# Altium schematic sheet ethernet_ipphone_sch.SchDoc: IP PHONE Ethernet
size A3; SheetNumber: 1; SheetTotal: 1
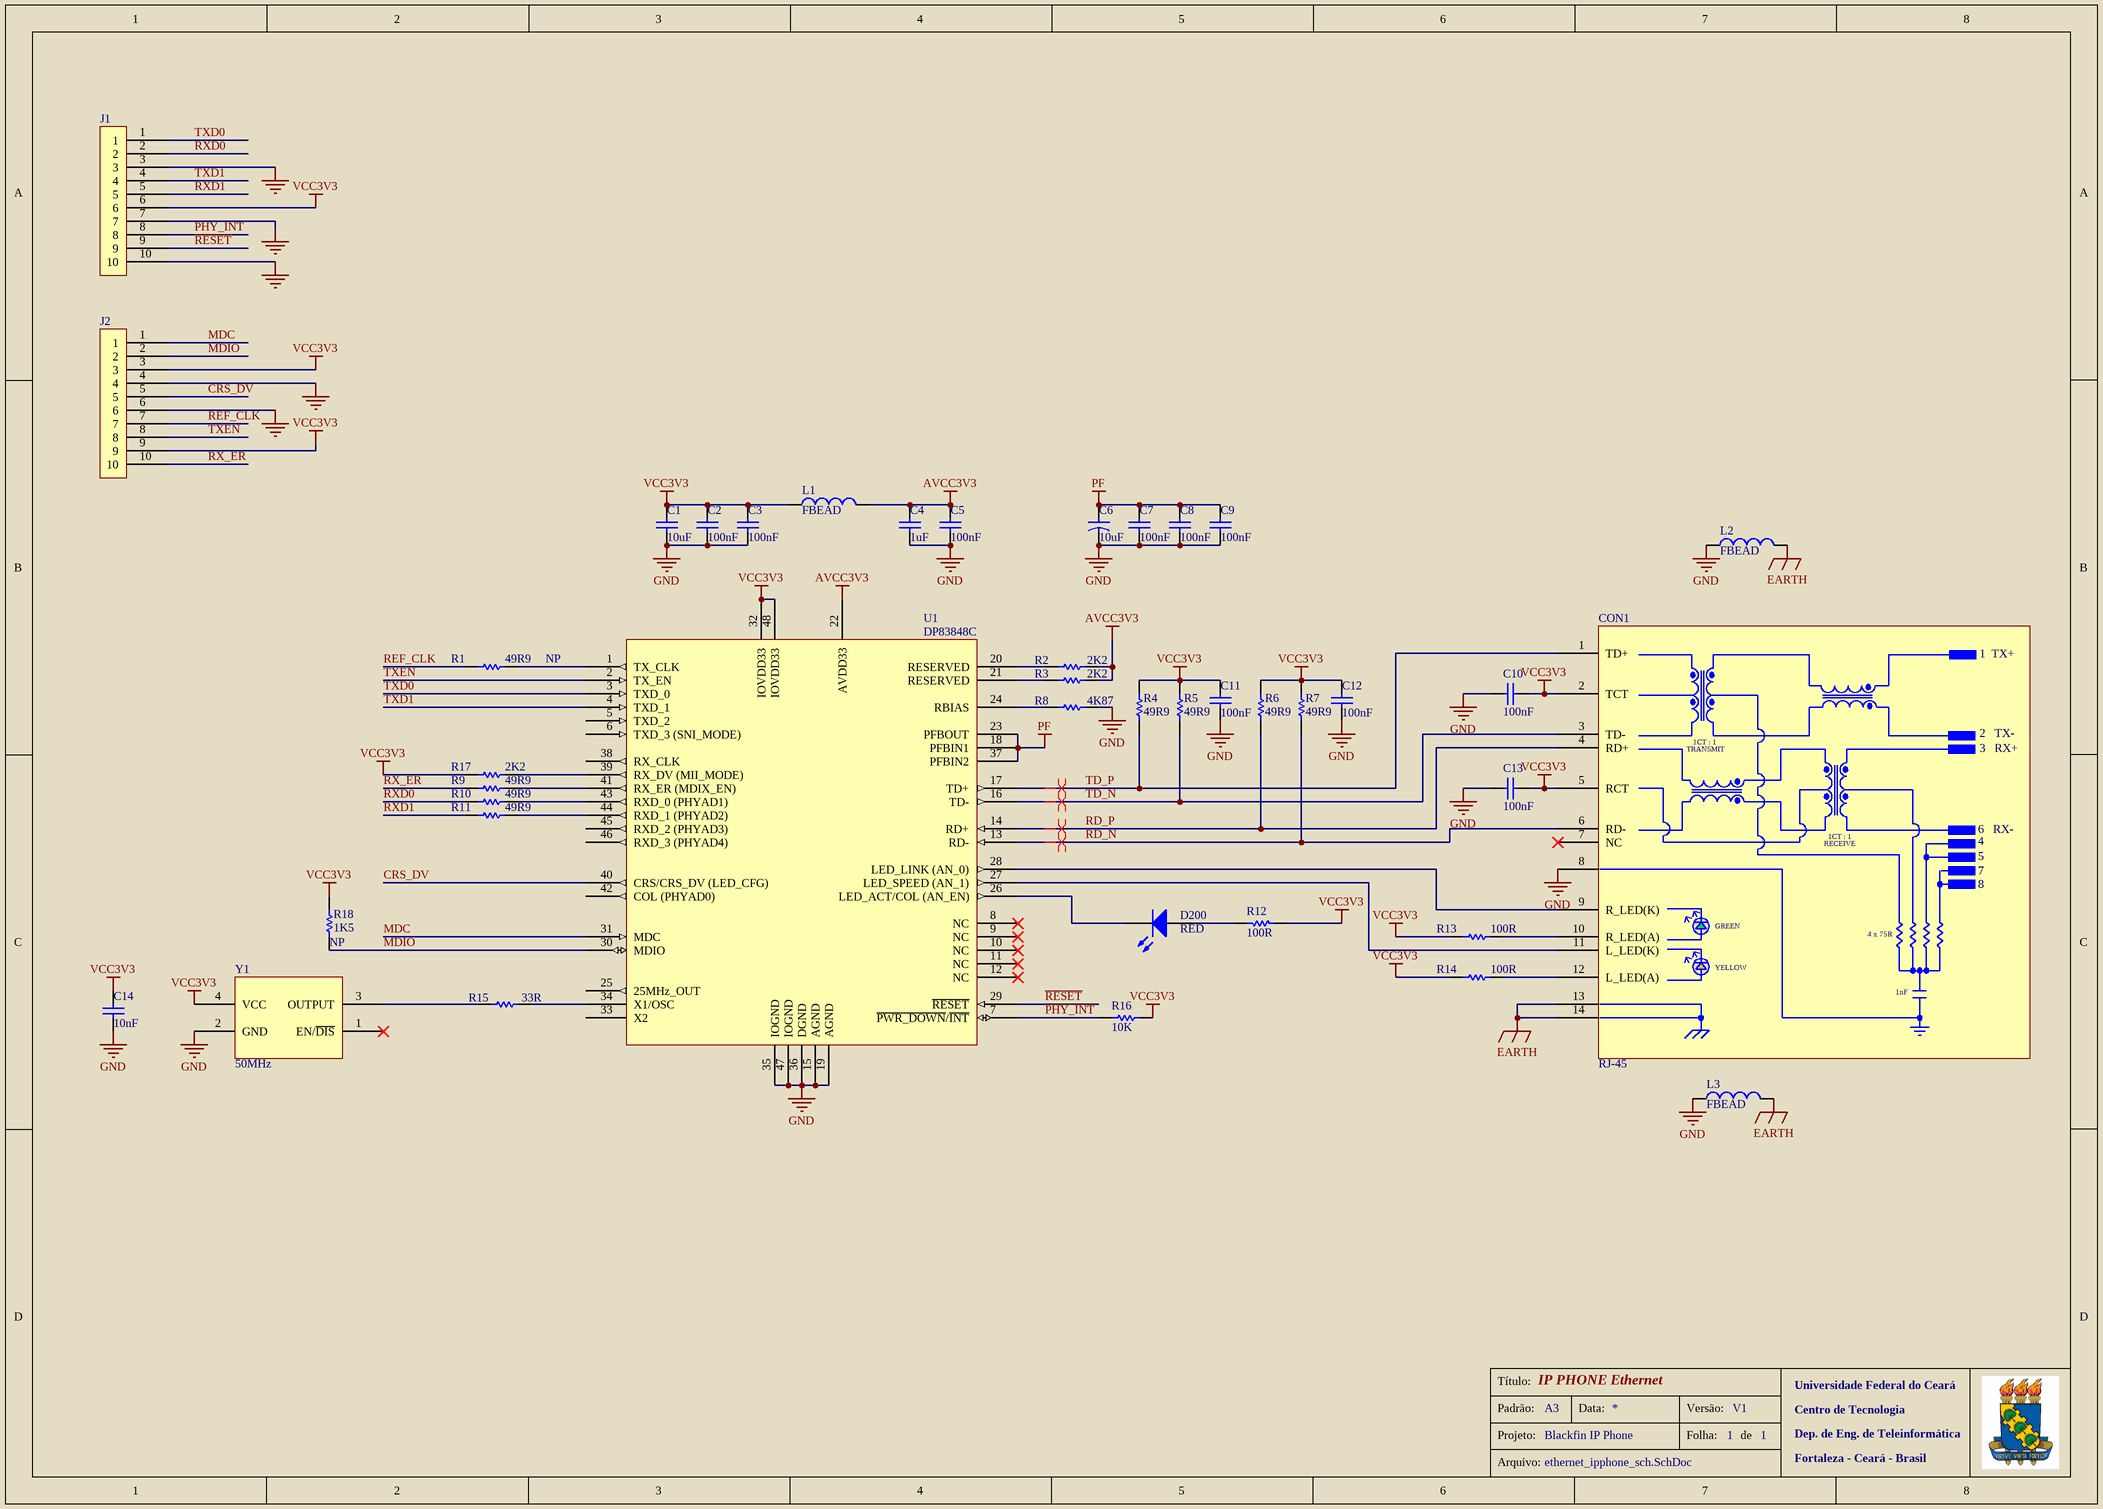
[diagram p0: ethernet_ipphone_sch.SchDoc]

## Parts
C1  10uF  [CC2012-0805]
C2  100nF  [CC1005-0402]
C3  100nF  [CC1005-0402]
C4  1uF  [CC1608-0603]
C5  100nF  [CC1005-0402]
C6  10uF  [C_Case_A]
C7  100nF  [CC1005-0402]
C8  100nF  [CC1005-0402]
C9  100nF  [CC1005-0402]
C10  100nF  [CC1005-0402]
C11  100nF  [CC1005-0402]
C12  100nF  [CC1005-0402]
C13  100nF  [CC1005-0402]
C14  10nF  [CC1005-0402]
CON1  RJ-45  [RJ-45]
D200  RED  [LED_0603]
J1  CONN HEADER  [CONECTOR_10_PIN]  (value not drawn)
J2  CONN HEADER  [CONECTOR_10_PIN]  (value not drawn)
L1  FBEAD  [INDUTOR_0603]
L2  FBEAD  [INDUTOR_0603]
L3  FBEAD  [INDUTOR_0603]
R1  49R9  [CR1005-0402_NP]
R2  2K2  [CR1005-0402]
R3  2K2  [CR1005-0402]
R4  49R9  [CR1005-0402]
R5  49R9  [CR1005-0402]
R6  49R9  [CR1005-0402]
R7  49R9  [CR1005-0402]
R8  4K87  [CR1608-0603]
R9  49R9  [CR1005-0402]
R10  49R9  [CR1005-0402]
R11  49R9  [CR1005-0402]
R12  100R  [CR1608-0603]
R13  100R  [CR1608-0603]
R14  100R  [CR1608-0603]
R15  33R  [CR1005-0402]
R16  10K  [CR1005-0402]
R17  2K2  [CR1005-0402]
R18  1K5  [CR1608-0603]
U1  DP83848C  [LQFP48]
Y1  50MHz  [OSC_25MHz_PHY]

## Nets
AVCC3V3: C4.2 C5.2 L1.2 R2.2 R3.2 U1.22(AVDD33)
EARTH: CON1.13(GND) CON1.14(GND) L2.2 L3.2
GND: C1.1 C2.1 C3.1 C4.1 C5.1 C6.2 C7.1 C8.1 C9.1 C10.2 C11.1 C12.1 C13.2 C14.1 CON1.8(GND) J1.3 J1.7 J1.10 J2.4 J2.6 L2.1 L3.1 R8.2 U1.15(AGND) U1.19(AGND) U1.35(IOGND) U1.36(DGND) U1.47(IOGND) Y1.2(GND)
PF: C6.1 C7.2 C8.2 C9.2 U1.18(PFBIN1) U1.23(PFBOUT) U1.37(PFBIN2)
VCC3V3: C1.2 C2.2 C3.2 C10.1 C11.2 C12.2 C13.1 C14.2 CON1.2(TCT) CON1.5(RCT) J1.6 J2.3 J2.9 L1.1 R4.2 R5.2 R6.2 R7.2 R12.2 R13.2 R14.2 R16.1 R17.2 R18.1 U1.32(IOVDD33) U1.48(IOVDD33) Y1.4(VCC)
~{RESET}: J1.9 U1.29(~{RESET})
CRS_DV: J2.5 U1.40(CRS/CRS_DV_(LED_CFG))
MDC: J2.1 U1.31(MDC)
MDIO: J2.2 R18.2 U1.30(MDIO)
~{PHY_INT}: J1.8 R16.2 U1.7(~{PWR_DOWN}/~{INT})
RD_N: CON1.6(RD-) R7.1 U1.13(RD-)
RD_P: CON1.4(RD+) R6.1 U1.14(RD+)
REF_CLK: J2.7 R1.1
RX_ER: J2.10 R9.1
RXD0: J1.2 R10.1
RXD1: J1.5 R11.1
TD_N: CON1.3(TD-) R5.1 U1.16(TD-)
TD_P: CON1.1(TD+) R4.1 U1.17(TD+)
TXD0: J1.1 U1.3(TXD_0)
TXD1: J1.4 U1.4(TXD_1)
TXEN: J2.8 U1.2(TX_EN)
NetCON1_9: CON1.9(R_LED(K)) U1.28(LED_LINK_(AN_0))
NetCON1_10: CON1.10(R_LED(A)) R13.1
NetCON1_11: CON1.11(L_LED(K)) U1.27(LED_SPEED_(AN_1))
NetCON1_12: CON1.12(L_LED(A)) R14.1
NetD200_1: D200.1(A) R12.1
NetD200_2: D200.2(K) U1.26(LED_ACT/COL_(AN_EN))
NetR1_2: R1.2 U1.1(TX_CLK)
NetR2_1: R2.1 U1.20(RESERVED)
NetR3_1: R3.1 U1.21(RESERVED)
NetR8_1: R8.1 U1.24(RBIAS)
NetR9_2: R9.2 U1.41(RX_ER_(MDIX_EN))
NetR10_2: R10.2 U1.43(RXD_0_(PHYAD1))
NetR11_2: R11.2 U1.44(RXD_1_(PHYAD2))
NetR15_1: R15.1 Y1.3(OUTPUT)
NetR15_2: R15.2 U1.34(X1/OSC)
NetR17_1: R17.1 U1.39(RX_DV_(MII_MODE))

Not connected (* = marked no-connect by the designer): CON1 7(NC)*; U1 5(TXD_2) 6(TXD_3_(SNI_MODE)) 8(NC)* 9(NC)* 10(NC)* 11(NC)* 12(NC)* 25(25MHz_OUT) 33(X2) 38(RX_CLK) 42(COL_(PHYAD0)) 45(RXD_2_(PHYAD3)) 46(RXD_3_(PHYAD4)); Y1 1(EN/~{DIS})*

## Layout directives
differential pair: RD_N, RD_P, TD_N, TD_P

## Notes on the sheet
- Título:
- Universidade Federal do Ceará
- Padrão:
- Projeto:
- A3
- Blackfin IP Phone
- Data:
- Versão:
- Folha:
- V1
- de
- Centro de Tecnologia
- Dep. de Eng. de Teleinformática
- Fortaleza - Ceará - Brasil
- Arquivo:
- (in symbol RJ-45) 1  TX+; 2   TX-; 1CT : 1; TRANSMIT; 3   RX+; 6   RX-; RECEIVE; GREEN; 4 x 75R; YELLOW; 1nF

## Library data of the parts
C1 = Capacitor: Capacitor SMD/SMT 0603 10uF 6.3volts X5R 20%; eVendorPart#: 810-C2012Y5V1A106Z; Manufacturer: TDK; Part#: C2012Y5V1A106ZT; eVendor: Mouser; eVendorPrice: 0,14; MSRP: 0,033; MOQ: 1000
C2 C3 C5 C7-C13 = Capacitor: MLCC - SMD/SMT 0.1UF 16V 10% 0402; eVendorPart#: 810-C1005X7R1C104K; Manufacturer: TDK; Part#: C1005X7R1C104KT; eVendor: Mouser; eVendorPrice: 0,03; MSRP: 0,005; MOQ: 1000
C4 = Capacitor: SMD/SMT 0603 1uF 25volts Y5V +80-20%; eVendorPart#: 81-GRM188F51E105ZA12; Manufacturer: Murata; Part#: GRM188F51E105ZA12D; eVendor: Mouser; eVendorPrice: 0,1; MSRP: 0,013; MOQ: 1000
C6 = Capacitor_Tan: Tantalum Capacitors - Solid SMD 16volts 10uF 10%; eVendorPart#: 80-B45196H3106K109; Part#: B45196H3106K109V17; Manufacturer: Kemet; eVendor: Mouser; eVendorPrice: 0,22; MSRP: 0,122; MOQ: 1000
C14 = Capacitor: Capacitor SMD/SMT 0402 0.01uF 16volts X7R 10%; eVendorPart#: 810-C1005X7R1C103K; Manufacturer: TDK; Part#: C1005X7R1C103KT; eVendor: Mouser; eVendorPrice: 0,03; MSRP: 0,004; MOQ: 1000
CON1 = RJ-45: Ethernet & Telecom Connectors 1X1 RJ45 JACK; eVendorPart#: 673-J1012F01C; Part#: J1012F01C; Manufacturer: Pulse; eVendor: Mouser; eVendorPrice: 7,86; MSRP: 3,86; MOQ: 1000
D200 = LED: Part#: APT1608SURCK; Manufacturer: Kingbright; eVendorPart#: 604-APT1608SURCK; eVendor: Mouser; eVendorPrice: 0,16; MSRP: 0,06; MOQ: 1000
J1 J2 = Conector 10pin: CONN HEADER .050" 10POS PCB GOLD; eVendorPart#: S9014E-10-ND; Manufacturer: Sullins Connector Solutions; Part#: GRPB101VWVN-RC; eVendor: Digikey; eVendorPrice: 0,66; MSRP: 0,32775; MOQ: 1000
L1-L3 = Inductor: EMI Filter Beads, Chokes & Arrays 300ohms 100MHz 2A Monolithic 0603 SMD; eVendorPart#: 875-MI0603L301R-10; Manufacturer: Laird Technologies; Part#: MI0603L301R-10; eVendor: Mouser; eVendorPrice: 0,16; MSRP: 0,069; MOQ: 1000
R1 R4-R7 R9-R11 = Resistor: Thick Film Resistors - SMD 1/16watt 49.9ohms 1% 0402; eVendorPart#: 71-CRCW0402-49.9-E3; Manufacturer: Vishay/Dale; Part#: CRCW040249R9FKED; eVendor: Mouser; eVendorPrice: 0,07; MSRP: 0,015; MOQ: 1000; NP: NP
R2 R3 R17 = Resistor: Thick Film Resistors SMD 0402 2K2 5%  1/16 W; eVendorPart#: 311-2.2KJRCT-ND; Manufacturer: Yageo; Part#: RC0402JR-072K2L; eVendor: Digikey; eVendorPrice: 0,012; MSRP: 0,00253; MOQ: 1000
R8 = Resistor: SMD 1/10watt 4.87Kohms 1% 0603; eVendorPart#: 71-CRCW0603-4.87K-E3; Manufacturer: Vishay/Dale; Part#: CRCW06034K87FKEA; eVendor: Mouser; eVendorPrice: 0,08; MSRP: 0,015; MOQ: 1000
R12-R14 = Resistor: Thick Film Resistors 1/16WATT 100R 0402; eVendorPart#: 652-CR0603-JW-101GLF; Manufacturer: Bourns; Part#: CR0603-JW-101GLF; eVendor: Mouser; eVendorPrice: 0,06; MSRP: 0,01; MOQ: 1000
R15 = Resistor: Thick Film Resistors SMD 0402 33R 5%  1/16 W; eVendorPart#: 311-33JRCT-ND; Manufacturer: Yageo; Part#: RC0402JR-0733RL; eVendor: Digikey; eVendorPrice: 0,012; MSRP: 0,00253; MOQ: 1000
R16 = Resistor: Thick Film Resistors SMD 0402 10K 5%  1/16 W; eVendorPart#: 311-10KJRCT-ND; Manufacturer: Yageo; Part#: RC0402JR-0710KL; eVendor: Digikey; eVendorPrice: 0,012; MSRP: 0,00253; MOQ: 1000
R18 = Resistor: Thick Film Resistors 1.5KOHM 5% 1/10W; eVendorPart#: 52-CR0603-JW-152GLF; Manufacturer: Bourns; Part#: CR0603-JW-152GLF; eVendor: Mouser; eVendorPrice: 0,02; MSRP: 0,008; MOQ: 1000; NP: NP
U1 = DP83848C: IC TXRX ETHERNET PHYTER 48-LQFP; Manufacturer: National Semiconductor; Part#: DP83848CVV/NOPB; eVendorPart#: DP83848CVV-ND; eVendor: Digikey; MSRP: 3,672; eVendorPrice: 6,8; MOQ: 1000
Y1 = Oscillator_25MHz_Phy: OSC 50.0000 MHZ 3.3V SMD; eVendorPart#: CTX327LVCT-ND; Part#: CB3LV-3I-50M0000; Manufacturer: CTS-Frequency Controls; eVendor: Mouser; eVendorPrice: 1,85; MSRP: 1.43656; MOQ: 500